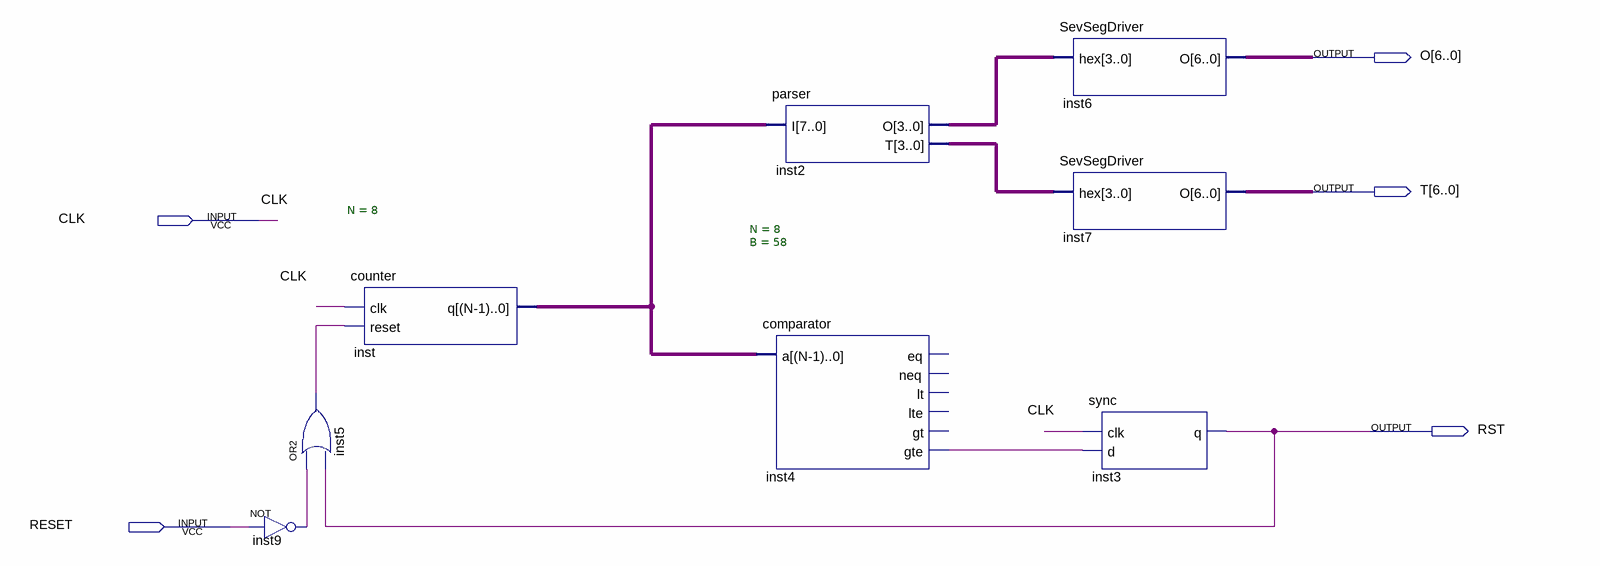
[diagram p0: schematic sheet]
// Quartus schematic clock.bdf as structural Verilog: 8 symbols, 5 pins
module clock (
  input  CLK,
  input  RESET,
  output [6:0] O,
  output [6:0] T,
  output RST
);

  wire inst4_gte, inst5_out, inst9_out;
  wire [3:0] inst2_o, inst2_t;
  wire [7:0] inst_q;

  not inst9 (inst9_out, RESET);
  counter #(.N(8)) inst (.clk(CLK), .reset(inst5_out), .q(inst_q));
  or inst5 (inst5_out, inst9_out, RST);
  parser inst2 (.I(inst_q), .O(inst2_o), .T(inst2_t));
  comparator #(.N(8), .B(58)) inst4 (.a(inst_q), .gte(inst4_gte));  // open: eq, neq, lt, lte, gt
  SevSegDriver inst6 (.hex(inst2_o), .O(O));
  SevSegDriver inst7 (.hex(inst2_t), .O(T));
  sync inst3 (.clk(CLK), .d(inst4_gte), .q(RST));
endmodule
